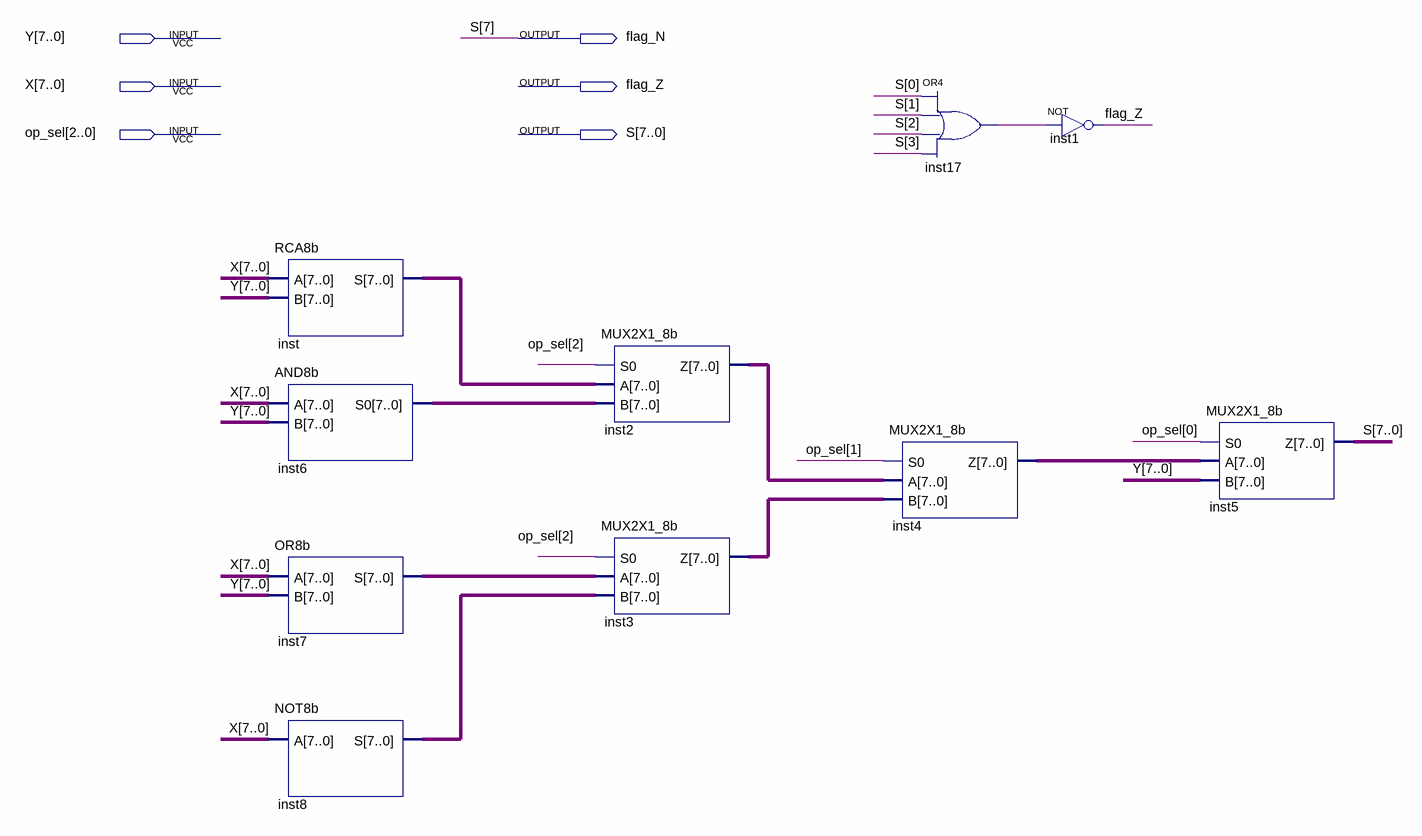
[diagram p0: schematic sheet]
// Quartus schematic ULA.bdf as structural Verilog: 10 symbols, 6 pins
module ULA (
  input  [7:0] Y,
  input  [7:0] X,
  input  [2:0] op_sel,
  output flag_N,
  output flag_Z,
  output [7:0] S
);

  wire inst17_out;
  wire [7:0] inst2_z, inst3_z, inst4_z, inst6_s0, inst7_s, inst8_s, inst_s;

  RCA8b inst (.A(X), .B(Y), .S(inst_s));
  AND8b inst6 (.A(X), .B(Y), .S0(inst6_s0));
  OR8b inst7 (.A(X), .B(Y), .S(inst7_s));
  NOT8b inst8 (.A(X), .S(inst8_s));
  MUX2X1_8b inst2 (.S0(op_sel[2]), .A(inst_s), .B(inst6_s0), .Z(inst2_z));
  MUX2X1_8b inst3 (.S0(op_sel[2]), .A(inst7_s), .B(inst8_s), .Z(inst3_z));
  or inst17 (inst17_out, S[0], S[1], S[2], S[3]);
  MUX2X1_8b inst4 (.S0(op_sel[1]), .A(inst2_z), .B(inst3_z), .Z(inst4_z));
  not inst1 (flag_Z, inst17_out);
  MUX2X1_8b inst5 (.S0(op_sel[0]), .A(inst4_z), .B(Y), .Z({flag_N, S[6:0]}));

  assign S[7] = flag_N;
endmodule
